# EAGLE design allegro bob alt (EAGLE 5.07)
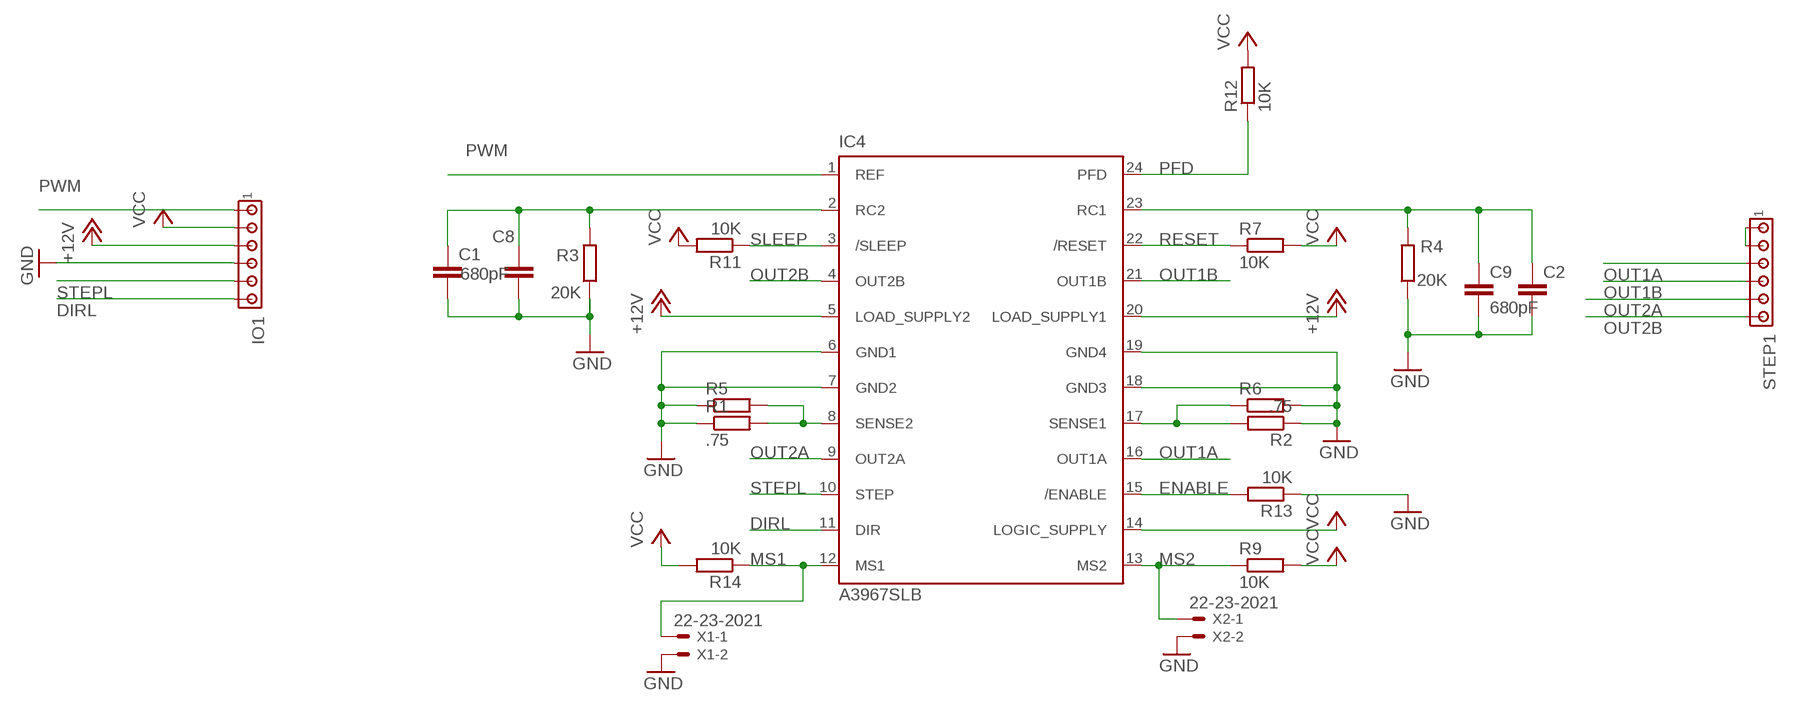
[diagram p0: schematic, sheet 1]

## Parts
C1  C-EU050-025X075  [C050-025X075]
C2  C-EU050-025X075  [C050-025X075]
C8  680pF  C-EUC1206  [C1206]
C9  680pF  C-EUC1206  [C1206]
IC4  A3967SLB  [SO24W]
IO1  MTA06-100  [10X06MTA]
R1  .75  R-EU_R1206  [R1206]
R2  .75  R-EU_R1206  [R1206]
R3  20K  R-EU_R1206  [R1206]
R4  20K  R-EU_R1206  [R1206]
R5  R-EU_0204/7  [0204/7]
R6  R-EU_0204/7  [0204/7]
R7  10K  R-EU_R1206  [R1206]
R9  10K  R-EU_R1206  [R1206]
R11  10K  R-EU_R1206  [R1206]
R12  10K  R-EU_R1206  [R1206]
R13  10K  R-EU_R1206  [R1206]
R14  10K  R-EU_R1206  [R1206]
STEP1  MTA06-100  [10X06MTA]
X1  22-23-2021  [22-23-2021]
X2  22-23-2021  [22-23-2021]

## Nets
+12V [power]: IC4.5(LOAD_SUPPLY2) IC4.20(LOAD_SUPPLY1) IO1.4
DIRL: IC4.11(DIR) IO1.1
ENABLE: IC4.15(/ENABLE) R13.2
GND: C1.2 C2.2 C8.2 C9.2 IC4.6(GND1) IC4.7(GND2) IC4.18(GND3) IC4.19(GND4) IO1.3 R1.1 R2.1 R3.1 R4.1 R5.1 R6.2 R13.1 X1.2 X2.2
MOTORSUPPLY [power]: STEP1.5 STEP1.6
MS1: IC4.12(MS1) R14.1 X1.1
MS2: IC4.13(MS2) R9.1 X2.1
N$3: IC4.8(SENSE2) R1.2 R5.2
N$14: IC4.17(SENSE1) R2.2 R6.1
N$16: C1.1 C8.1 IC4.2(RC2) R3.2
N$20: C2.1 C9.1 IC4.23(RC1) R4.2
OUT1A: IC4.16(OUT1A) STEP1.4
OUT1B: IC4.21(OUT1B) STEP1.3
OUT2A: IC4.9(OUT2A) STEP1.2
OUT2B: IC4.4(OUT2B) STEP1.1
PFD: IC4.24(PFD) R12.1
PWM: IC4.1(REF) IO1.6
RESET: IC4.22(/RESET) R7.1
SLEEP: IC4.3(/SLEEP) R11.1
STEPL: IC4.10(STEP) IO1.2
VCC: IC4.14(LOGIC_SUPPLY) IO1.5 R7.2 R9.2 R11.2 R12.2 R14.2

## Library data of the parts
C1 C2 C8 C9 = matt rcl:C-EU: CAPACITOR, European symbol
IC4 = Allegro:A3967SLB: ANALOG DEVICES
IO1 STEP1 = matt con-amp:MTA06-100: AMP connector
R1-R7 R9 R11-R14 = matt rcl:R-EU_: RESISTOR, European symbol
X1 X2 = con-molex:22-23-2021: .100" (2.54mm) Center Header - 2 Pin

## Net classes
1 power: width 2 mm

## Board
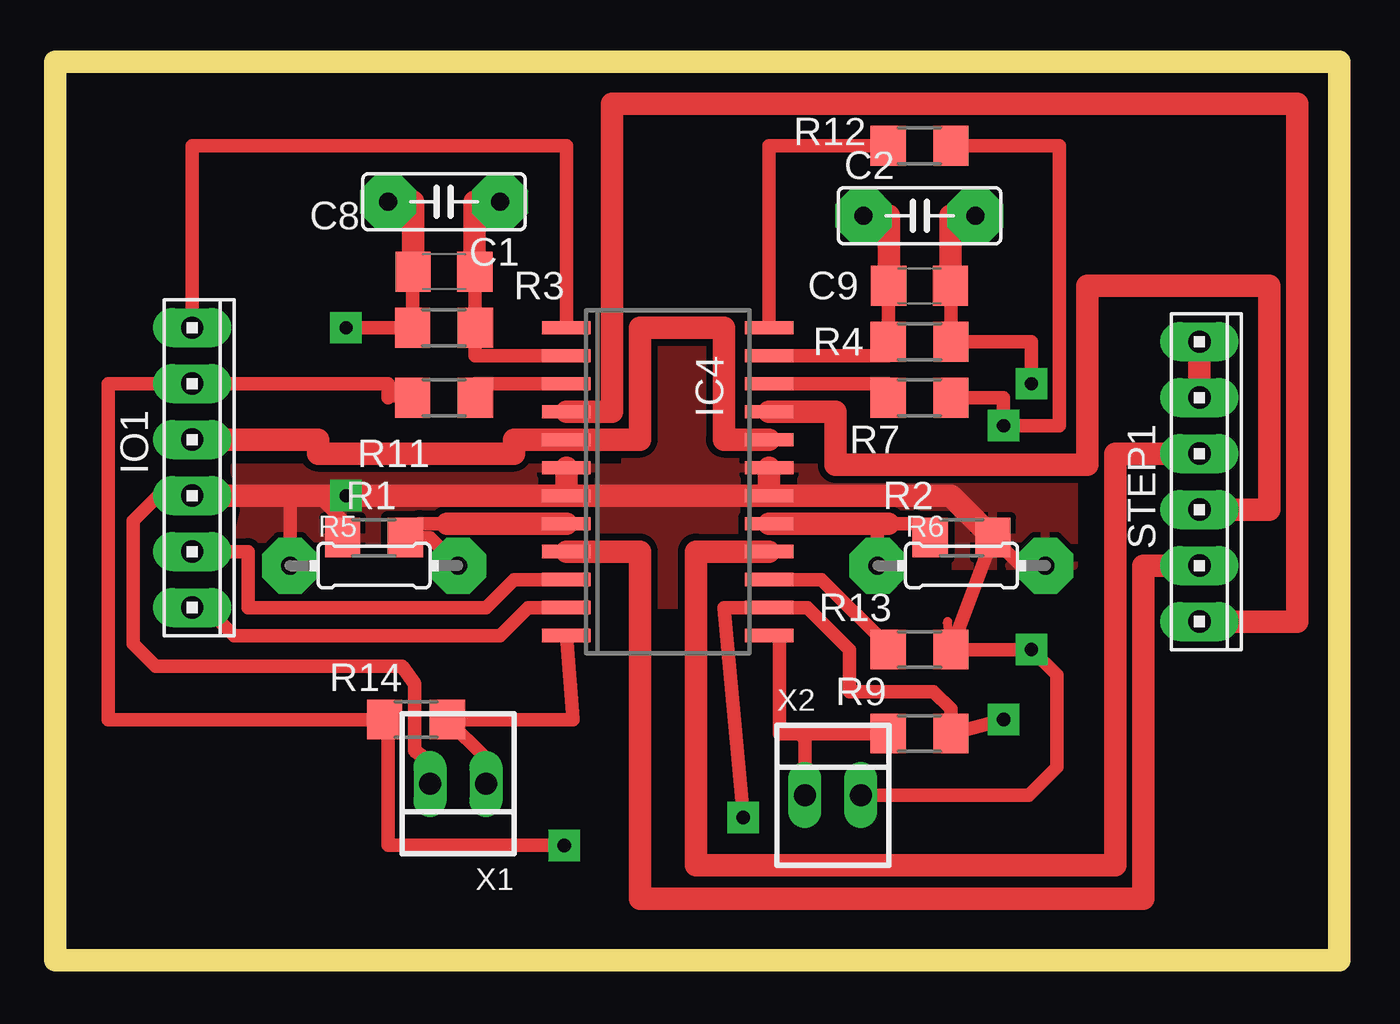
[diagram p1: board, top side]
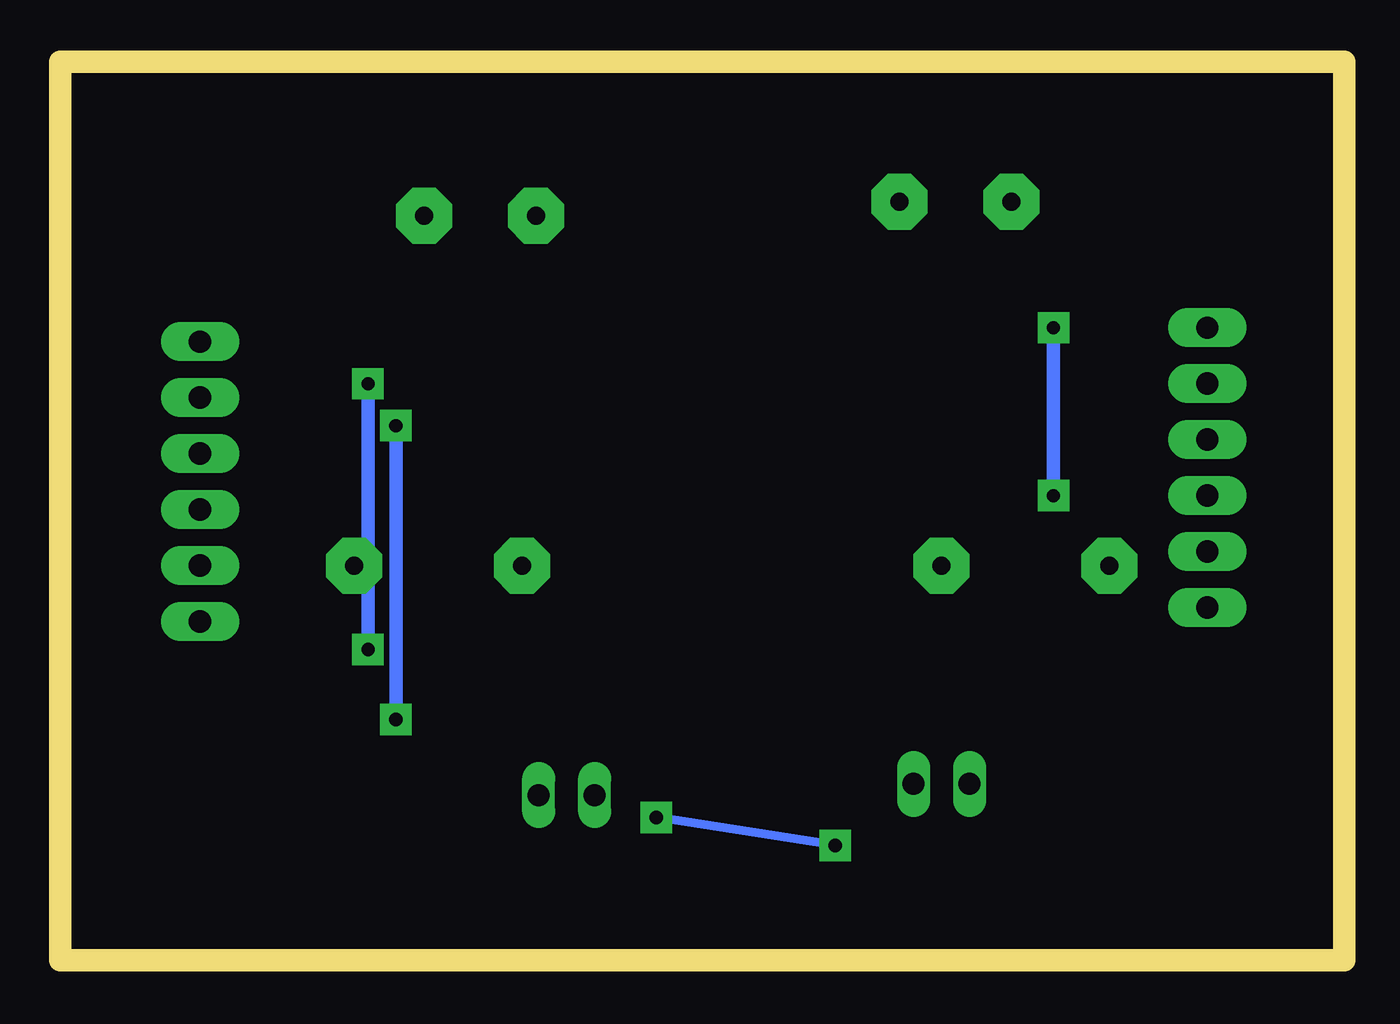
[diagram p2: board, bottom side, seen from below]

Size 58.53 x 41.45 mm. Coordinates in mm from the lower left corner, seen from the top.
Outline: 0,0.25 58.53,0 58.27,41.45 0,41.45 0,0.25
Copper layers (1*16): Top 0.035mm / dielectric 1.5mm / Bottom 0.035mm
Design rules "default": minimum track width 10mil, minimum drill 24mil, track to track 8mil, track to pad 8mil, pad to pad 8mil, via to via 8mil, smd to smd 8mil, copper to edge 40mil, drill to drill 8mil, minimum pad ring 10mil, minimum via ring 8mil, stop-mask expansion 4mil, vias tented up to drill 0mil, thermal gap 10mil
Milling: 4 lines

### Footprints (pad centres in the part's own frame; a part is rotated, then mirrored left to right if it is on the bottom)
C050-025X075 = drill 0.813 pad 2.54 octagon: 1 -2.54,0; 2 2.54,0
C1206 = smd 1.6 x 1.8: 1 -1.4,0; 2 1.4,0
SO24W = smd 0.6 x 2.2: 1 -6.985,-4.6; 2 -5.715,-4.6; 3 -4.445,-4.6; 4 -3.175,-4.6; 5 -1.905,-4.6; 6 -0.635,-4.6; 7 0.635,-4.6; 8 1.905,-4.6; 9 3.175,-4.6; 10 4.445,-4.6; 11 5.715,-4.6; 12 6.985,-4.6; 13 6.985,4.6; 14 5.715,4.6; 15 4.445,4.6; 16 3.175,4.6; 17 1.905,4.6; 18 0.635,4.6; 19 -0.635,4.6; 20 -1.905,4.6; 21 -3.175,4.6; 22 -4.445,4.6; 23 -5.715,4.6; 24 -6.985,4.6
10X06MTA = drill 1.016 pad 1.778 long: 1 6.35,0; 2 3.81,0; 3 1.27,0; 4 -1.27,0; 5 -3.81,0; 6 -6.35,0
R1206 = smd 1.6 x 1.803: 1 -1.422,0; 2 1.422,0
0204/7 = drill 0.813 pad 2.54 octagon: 1 -3.81,0; 2 3.81,0
22-23-2021 = drill 1 long: 1 -1.27,0; 2 1.27,0

### Placement (x,y rotation side)
C1  17.65,34.8 180 top
C2  39.24,34.16 0 top
C8  17.65,31.62 180 top
C9  39.24,30.99 0 top
IC4  27.81,22.1 270 top
IO1  6.22,22.73 270 top
R1  14.48,19.56 0 top
R2  41.15,19.56 180 top
R3  17.65,29.08 0 top
R4  39.24,28.45 180 top
R5  14.48,18.29 0 top
R6  41.15,18.29 0 top
R7  39.24,25.91 0 top
R9  39.24,10.67 0 top
R11  17.65,25.91 180 top
R12  39.24,37.34 0 top
R13  39.24,14.48 180 top
R14  16.38,11.3 180 top
STEP1  51.94,22.1 270 top
X1  18.29,8.38 180 top
X2  35.31,7.87 0 top

### Tracks (layer width: path | path; a pad name or v marks a point on that pad's centre or on a via)
+12V
  Top 1.016: IO1.4 11.94,24 11.94,23.37 20.83,23.37 20.83,24 IC4.5 26.54,24 26.54,29.08 30.35,29.08 30.35,24 IC4.20
DIRL
  Top 0.61: IO1.1 6.86,16.38 8.13,15.11 20.19,15.11 21.46,16.38 IC4.11
ENABLE
  Top 0.61: R13.2 37.82,14.63 34.8,17.65 IC4.15
GND  (via drill 0.6 pad 1.42)
  Top 0.406: R13.1 40.51,15.75 | 40.66,30.99 C9.2
  Top 0.61: C8.2 16.23,30.35 R3.1 v13.21,29.08 | v44.32,26.54 44.32,28.45 R4.1 40.66,30.99 | 10.67,21.46 R5.1 | R1.1 13.06,20.34 11.94,21.46 | R6.2 43.84,18.29 R2.1 R13.1 v44.32,14.48 45.47,13.34 45.47,9.14 44.2,7.87 X2.2 | X1.2 17.02,9.4 16.32,9.89 16.32,12.94 15.75,13.72 4.57,13.72 3.56,14.73 3.56,20.32 4.83,21.59 6.1,21.59 IO1.3
  Top 1.016: IC4.7 IC4.6 | IC4.18 IC4.19 | IC4.7 IC4.18 | IC4.18 40.66,21.46 R2.1 | IO1.3 10.67,21.46 11.94,21.46 v13.21,21.46 IC4.7 | C1.2 16.25,34.8 C8.2 | C2.2 40.64,34.16 C9.2
  Bottom 0.61: v44.32,14.48 v44.32,26.54 | v13.21,21.46 v13.21,29.08
  pour Top (isolate 0.305): 8.13,22.73 25.91,22.73 25.91,29.72 32.89,29.72 32.89,22.73 46.23,22.73 46.23,18.29 30.35,18.29 30.23,16.51 20.57,16.51 20.57,19.3 8.38,19.3 8.38,19.81 8.64,20.83
MOTORSUPPLY
  Top 1.016: STEP1.5 STEP1.6
MS1
  Top 0.61: IC4.12 23.52,11.3 R14.1 19.56,9.55 X1.1
MS2
  Top 0.61: IC4.13 32.89,15.11 32.89,10.67 33.78,10.67 | 33.78,10.67 R9.1 | X2.1 34.04,10.41 33.78,10.67
N$3
  Top 0.61: R5.2 17.02,19.56 R1.2 16.54,20.19 17.8,20.19
  Top 1.016: 17.8,20.19 IC4.8
N$14
  Top 0.61: 37.82,20.19 39.09,20.19 R2.2 | 37.34,20.19 R6.1
  Top 1.016: IC4.17 37.34,20.19 37.82,20.19
N$16
  Top 0.61: IC4.2 19.08,27.81 R3.2 19.08,30.35 C8.1
  Top 1.016: C1.1 19.05,34.8 C8.1
N$20
  Top 0.406: 37.82,30.99 C9.1 | 37.82,27.81 R4.2
  Top 0.61: R4.2 37.82,30.99 | IC4.23 37.82,27.81
  Top 1.016: C2.1 37.84,34.16 C9.1
OUT1A
  Top 1.016: IC4.16 29.08,18.92 29.08,4.7 48.13,4.7 48.13,23.37 STEP1.4
OUT1B
  Top 1.016: IC4.21 35.43,25.27 35.43,22.86 46.86,22.86 46.86,30.99 55.12,30.99 55.12,20.83 STEP1.3
OUT2A
  Top 1.016: IC4.9 26.54,18.92 26.54,3.18 49.4,3.18 49.4,18.29 STEP1.2
OUT2B
  Top 1.016: STEP1.1 56.39,15.75 56.39,39.24 25.27,39.24 25.27,25.27 IC4.4
PFD
  Top 0.61: R12.1 32.41,37.34 IC4.24
PWM
  Top 0.61: IO1.6 6.22,37.34 23.21,37.34 IC4.1
RESET
  Top 0.406: 37.82,26.54 R7.1
  Top 0.61: IC4.22 37.82,26.54
SLEEP
  Top 0.406: R11.1 19.08,26.54
  Top 0.61: 19.08,26.54 IC4.3
STEPL
  Top 0.61: IO1.2 8.76,18.92 8.76,16.38 19.56,16.38 20.83,17.65 IC4.10
VCC  (via drill 0.6 pad 1.42)
  Top 0.406: R14.2 15.11,11.3 | 15.11,25.91 R11.2
  Top 0.61: 15.11,11.3 15.11,5.59 v23.11,5.59 | v31.24,6.86 30.35,16.38 IC4.14 34.16,16.38 36.07,14.48 36.07,12.57 39.88,12.57 40.66,11.79 R9.2 v43.05,11.3 | R7.2 43.05,25.91 v43.05,24.64 45.59,24.64 45.59,37.34 R12.2 | R14.2 2.41,11.3 2.41,26.54 IO1.5 15.11,26.54 15.11,25.91
  Bottom 0.406: v23.11,5.59 v31.24,6.86
  Bottom 0.61: v43.05,11.3 v43.05,24.64